# Altium project IBB.PrjPcb (part 1 of 11)
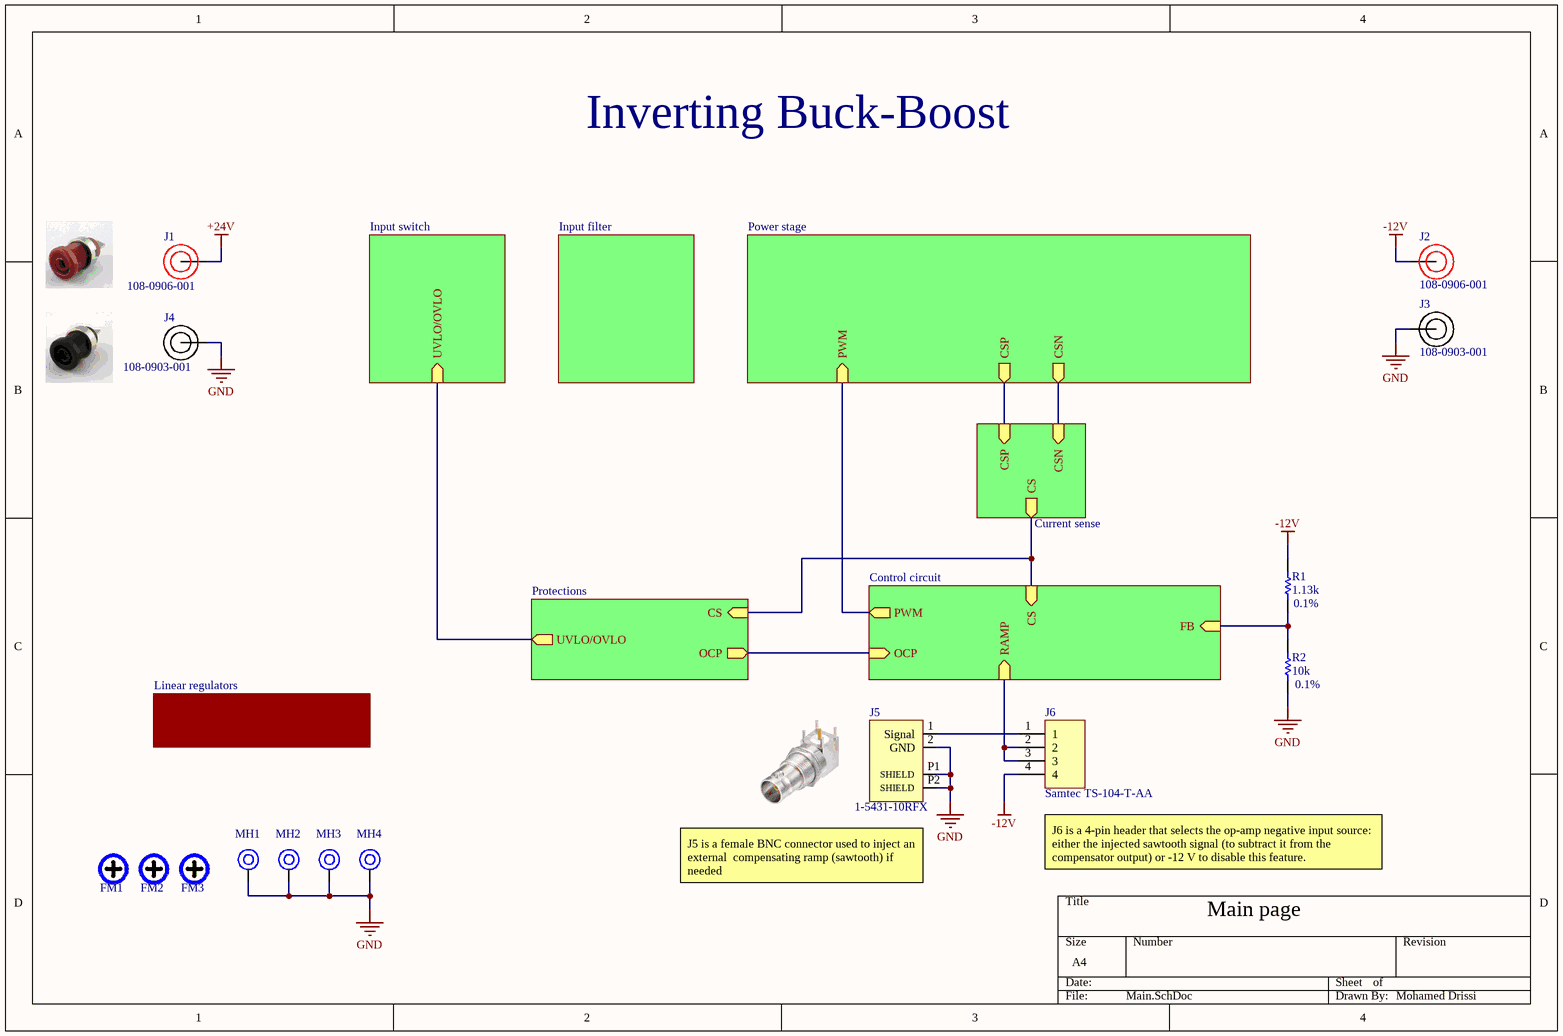
[diagram p0: Main.SchDoc]
Inverting buck boost: Project; Mohamed Drissi: Designer
8 sheets, 213 parts. Net scope: hierarchical (ports join the sheet entries above them; power ports are global).
Board file: PCB.PcbDoc
Sheets:
  Main.SchDoc
    Power stage = Power stage.SchDoc
    Current sense = current sense.SchDoc
    Input switch = Input switch.SchDoc
    Input filter = Input filter.SchDoc
    Protections = Protections.SchDoc
    Linear regulators = Linear regulators.SchDoc
    Control circuit = Control circuit.SchDoc

## Sheet Main.SchDoc
size A4; SheetNumber: 1; SheetTotal: 8

### Parts
FM1  Fiducial Marker  [FIDUCIAL_CROSS_1MM5]  (value not drawn)  (no BOM)
FM2  Fiducial Marker  [FIDUCIAL_CROSS_1MM5]  (value not drawn)  (no BOM)
FM3  Fiducial Marker  [FIDUCIAL_CROSS_1MM5]  (value not drawn)  (no BOM)
J1  108-0906-001  [Black Banana connector Solder terminal]
J2  108-0906-001  [Black Banana connector Solder terminal]
J3  108-0903-001  [Black Banana connector Solder terminal]
J4  108-0903-001  [Black Banana connector Solder terminal]
J5  031-5431-10RFX  [031-5431-10RFX BNC]
J6  Samtec TS-104-T-AA  [CONN HEADER VERT 4POS 2.54MM]
MH1  Mounting Hole  [MOUNTING]  (value not drawn)  (no BOM)
MH2  Mounting Hole  [MOUNTING]  (value not drawn)  (no BOM)
MH3  Mounting Hole  [MOUNTING]  (value not drawn)  (no BOM)
MH4  Mounting Hole  [MOUNTING]  (value not drawn)  (no BOM)
R1  Tolerance: 0.1%  Resistance: 1.13k  [RES_0603]  (hidden comment: RT0603BRD071K13L)
R2  Tolerance: 0.1%  Resistance: 10k  [res_0603]  (hidden comment: ERA-3AEB103V)

### Sub-sheets
Control circuit = Control circuit.SchDoc: FB (in), CS (in), RAMP (in), PWM (out), OCP (in)
Current sense = current sense.SchDoc: CSP (in), CSN (in), CS (out)
Input filter = Input filter.SchDoc: no entries
Input switch = Input switch.SchDoc: UVLO/OVLO (in)
Linear regulators = Linear regulators.SchDoc: no entries
Power stage = Power stage.SchDoc: CSN (out), CSP (out), PWM (in)
Protections = Protections.SchDoc: UVLO/OVLO (out), CS (in), OCP (out)

### Nets
+24V: J1.1
-12V: J2.1 J6.4 R1.2
GND: J3.1 J4.1 J5.2(GND) J5.P1(SHIELD) J5.P2(SHIELD) MH1.1 MH2.1 MH3.1 MH4.1 R2.1
NetC26_1: sheet Power stage/CSN, sheet Current sense/CSN
NetC26_2: sheet Power stage/CSP, sheet Current sense/CSP
NetJ5_1: J5.1(Signal) J6.1
NetJ6_2: J6.2 J6.3 ; sheet Control circuit/RAMP
NetQ3_2: sheet Protections/OCP, sheet Control circuit/OCP
NetQ8_1: sheet Input switch/UVLO/OVLO, sheet Protections/UVLO/OVLO
NetR1_1: R1.1 R2.2 ; sheet Control circuit/FB
NetR77_2: sheet Power stage/PWM, sheet Control circuit/PWM
NetU6_1: sheet Current sense/CS, sheet Protections/CS, sheet Control circuit/CS

### Notes on the sheet
- Inverting Buck-Boost
- (near J5) J5 is a female BNC connector used to inject an external  compensating ramp (sawtooth) if needed
- (near J6) J6 is a 4-pin header that selects the op-amp negative input source: either the injected sawtooth signal (to subtract it from the compensator output) or -12 V to disable this feature.
- Main page
- Mohamed Drissi

### Library data of the parts
FM1-FM3 = FIDUCIAL_CROSS_1MM5: Fiducial Marker Cross 1.5mm NO BOM
J1 J2 = Cinch 108-0906-001: Right-angle Dual Port D-Sub Connector; Manufacturer: Cinch Connectivity Solutions; Approvals: UL; Body Material: Brass, Nylon, Polyamide; Current Rating: 15A; Gender: Female; Insulation: Mating End Insulated; Number of Contacts: 1; Voltage Rating: 3.5kV; Voltage Rating (DC): 7kV; Wire/Cable Gauge: 12AWG; Supplier: Avnet; Supplier Part Number: 39F1578; Manufacturer Part Number: 108-0906-001; RoHS: Compliant; Category: Connectors; Stock: 6182; Pricing: 1=1,33, 10=1,13, 50=1,03, 100=0,961, 250=0,9, 500=0,857, 1000=0,816 (USD); Case/Package: 0906; Color: Orange; Contact Material: Brass; Contact Plating: Tin; Export Control Classification Number (ECCN) Code: EAR99; Insulation Material: Nylon; Lead Free: Lead Free; Length: 23.83mm; Lifecycle Status: Production; Max Current Rating: 15A; Max Operating Temperature: 85°C; Min Operating Temperature: -55°C; Mounting Technology: Panel; Orientation: Straight; Packaging: Bulk; Radiation Hardening: No; REACH SVHC: No; Termination: Solder; ComponentLink1URL: https://datasheet.octopart.com:443/108-0906-001-Cinch-Connectors-datasheet-87927859.pdf?src-supplier=element14+APAC; ComponentLink1Description: https://datasheet.octopart.com:443/108-0906-001-Cinch-Connectors-datasheet-87927859.pdf?src-supplier=element14+APAC; ComponentLink2URL: https://datasheet.octopart.com:443/108-0906-001-Cinch-Connectors-datasheet-26078.pdf?src-supplier=element14+APAC; ComponentLink2Description: https://datasheet.octopart.com:443/108-0906-001-Cinch-Connectors-datasheet-26078.pdf?src-supplier=element14+APAC; ComponentLink3URL: https://datasheet.octopart.com:443/108-0906-001-Cinch-Connectivity-Solutions-datasheet-180501184.pdf?src-supplier=IHS; ComponentLink3Description: https://datasheet.octopart.com:443/108-0906-001-Cinch-Connectivity-Solutions-datasheet-180501184.pdf?src-supplier=IHS; ComponentLink4URL: https://datasheet.octopart.com:443/108-0906-001-Cinch-Connectors-datasheet-13703871.pdf?src-supplier=_legacy+Avnet; ComponentLink4Description: https://datasheet.octopart.com:443/108-0906-001-Cinch-Connectors-datasheet-13703871.pdf?src-supplier=_legacy+Avnet; ComponentLink5URL: https://datasheet.octopart.com:443/108-0906-001-Cinch-Connectivity-Solutions-datasheet-128871933.pdf?src-supplier=RS+(Formerly+Allied+Electronics); ComponentLink5Description: https://datasheet.octopart.com:443/108-0906-001-Cinch-Connectivity-Solutions-datasheet-128871933.pdf?src-supplier=RS+(Formerly+Allied+Electronics); ComponentLink6URL: https://datasheet.octopart.com:443/108-0906-001-Cinch-Connectors-datasheet-10014739.pdf?src-supplier=RS+(Formerly+Allied+Electronics); ComponentLink6Description: https://datasheet.octopart.com:443/108-0906-001-Cinch-Connectors-datasheet-10014739.pdf?src-supplier=RS+(Formerly+Allied+Electronics); ComponentLink7URL: https://datasheet.octopart.com:443/108-0906-001-Emerson-Network-Power-datasheet-16473276.pdf?src-supplier=Farnell; ComponentLink7Description: https://datasheet.octopart.com:443/108-0906-001-Emerson-Network-Power-datasheet-16473276.pdf?src-supplier=Farnell
J3 J4 = Cinch 108-0903-001: Banana Test Connector, 4mm, Jack, Panel Mount, 15 A, 7 kV, Tin Plated Contacts, Black; Manufacturer: Cinch Connectivity Solutions; Approvals: UL; Body Material: Brass, Nylon, Polyamide; Current Rating: 15A; Gender: Female; Insulation: Mating End Insulated; Number of Contacts: 1; Voltage Rating: 3.5kV; Voltage Rating (DC): 7kV; Wire/Cable Gauge: 12AWG; Supplier: RS; Supplier Part Number: 8860910; Manufacturer Part Number: 108-0903-001; RoHS: Compliant; Category: Connectors; Stock: 5600; Pricing: 50=0,928, 500=0,742, 1000=0,699 (EUR); Color: Black; Contact Material: Tin; Contact Plating: Tin; Country of Origin: USA; Export Control Classification Number (ECCN) Code: EAR99; Insulation Material: Nylon; Lead Free: Lead Free; Length: 23.83mm; Lifecycle Status: Production; Max Current Rating: 15A; Max Operating Temperature: 85°C; Min Operating Temperature: -55°C; Mounting Technology: Panel; Orientation: Straight; Packaging: Bulk; Radiation Hardening: No; REACH SVHC: No; Termination: Solder; ComponentLink1URL: https://datasheet.octopart.com:443/108-0903-001-Cinch-Connectivity-Solutions-datasheet-128871933.pdf?src-supplier=JRH+Electronics; ComponentLink1Description: https://datasheet.octopart.com:443/108-0903-001-Cinch-Connectivity-Solutions-datasheet-128871933.pdf?src-supplier=JRH+Electronics; ComponentLink2URL: https://datasheet.octopart.com:443/108-0903-001-Cinch-Connectors-datasheet-38159153.pdf?src-supplier=element14+APAC; ComponentLink2Description: https://datasheet.octopart.com:443/108-0903-001-Cinch-Connectors-datasheet-38159153.pdf?src-supplier=element14+APAC; ComponentLink3URL: https://datasheet.octopart.com:443/108-0903-001-Cinch-Connectivity-Solutions-datasheet-180501184.pdf?src-supplier=IHS; ComponentLink3Description: https://datasheet.octopart.com:443/108-0903-001-Cinch-Connectivity-Solutions-datasheet-180501184.pdf?src-supplier=IHS; ComponentLink4URL: https://datasheet.octopart.com:443/108-0903-001-Emerson-Network-Power-datasheet-82039.pdf?src-supplier=element14; ComponentLink4Description: https://datasheet.octopart.com:443/108-0903-001-Emerson-Network-Power-datasheet-82039.pdf?src-supplier=element14; ComponentLink5URL: https://datasheet.octopart.com:443/108-0903-001-Cinch-Connectors-datasheet-13701575.pdf?src-supplier=_legacy+Avnet; ComponentLink5Description: https://datasheet.octopart.com:443/108-0903-001-Cinch-Connectors-datasheet-13701575.pdf?src-supplier=_legacy+Avnet; ComponentLink6URL: https://datasheet.octopart.com:443/108-0903-001-Cinch-Connectors-datasheet-9780463.pdf?src-supplier=RS+(Formerly+Allied+Electronics); ComponentLink6Description: https://datasheet.octopart.com:443/108-0903-001-Cinch-Connectors-datasheet-9780463.pdf?src-supplier=RS+(Formerly+Allied+Electronics); ComponentLink7URL: https://datasheet.octopart.com:443/108-0903-001-Emerson-Network-Power-datasheet-8828422.pdf?src-supplier=Farnell; ComponentLink7Description: https://datasheet.octopart.com:443/108-0903-001-Emerson-Network-Power-datasheet-8828422.pdf?src-supplier=Farnell; ComponentLink8URL: https://datasheet.octopart.com:443/108-0903-001-Emerson-Network-Power-datasheet-10031126.pdf?src-supplier=Farnell; ComponentLink8Description: https://datasheet.octopart.com:443/108-0903-001-Emerson-Network-Power-datasheet-10031126.pdf?src-supplier=Farnell; ComponentLink9URL: https://datasheet.octopart.com:443/108-0903-001-Emerson-Network-Power-datasheet-47159.pdf?src-supplier=Farnell; ComponentLink9Description: https://datasheet.octopart.com:443/108-0903-001-Emerson-Network-Power-datasheet-47159.pdf?src-supplier=Farnell; ComponentLink10URL: https://datasheet.octopart.com:443/108-0903-001-Emerson-Network-Power-datasheet-40124.pdf?src-supplier=Farnell; ComponentLink10Description: https://datasheet.octopart.com:443/108-0903-001-Emerson-Network-Power-datasheet-40124.pdf?src-supplier=Farnell; ComponentLink11URL: https://datasheet.octopart.com:443/108-0903-001-Emerson-Network-Power-datasheet-29036.pdf?src-supplier=Farnell; ComponentLink11Description: https://datasheet.octopart.com:443/108-0903-001-Emerson-Network-Power-datasheet-29036.pdf?src-supplier=Farnell
J5 = Amphenol 031-5431-10RFX: RF BNC Connector, Female, Panel Mount, Board And Panel Mount, Solder Terminal, Jack; Manufacturer: Amphenol RF; Body Material: Zinc; Body Plating: Nickel; Connector Type: Receptacle; Dielectric Material: Polypropylene; Frequency: 4GHz; Impedance: 50Ω; Insertion Loss (dB): 0.2dB; Clock Frequency: 1GHz; Polarity: Standard; Voltage Rating: 500V; Supplier: RS; Supplier Part Number: 1440890; Manufacturer Part Number: 031-5431-10RFX; RoHS: Compliant; Category: RF / Coaxial Connectors; Stock: 106; Pricing: 2=3,93, 20=3,77, 40=3,46, 100=3,145, 200=2,985 (EUR); Contact Material: Bronze, Copper; Contact Plating: Gold; Export Control Classification Number (ECCN) Code: EAR99; Fastening Type: Bayonet; Gender: Female; Housing Color: White; Harmonized Tariff Schedule (HTS) Code: 8536.69.40.10; Introduction Date: 2000-11-01; Lifecycle Status: Production; Max Operating Temperature: 85°C; Min Operating Temperature: -55°C; Mounting Technology: Bulkhead, PCB, Panel, Through Hole; Orientation: Right Angle; Plating: Nickel; Radiation Hardening: No; REACH SVHC: Unknown; Schedule B: 8536695050, 8536695050|8536695050, 8536695050|8536695050|8536695050, 8536695050|8536695050|8536695050|8536695050; Termination: Solder; ComponentLink1URL: https://datasheet.octopart.com:443/031-5431-10RFX-Amphenol-RF-datasheet-178912673.pdf?src-supplier=Amphenol+RF; ComponentLink1Description: https://datasheet.octopart.com:443/031-5431-10RFX-Amphenol-RF-datasheet-178912673.pdf?src-supplier=Amphenol+RF; ComponentLink2URL: https://datasheet.octopart.com:443/031-5431-10RFX-Amphenol-RF-datasheet-69052.pdf?src-supplier=RS+(Formerly+Allied+Electronics); ComponentLink2Description: https://datasheet.octopart.com:443/031-5431-10RFX-Amphenol-RF-datasheet-69052.pdf?src-supplier=RS+(Formerly+Allied+Electronics); ComponentLink3URL: https://datasheet.octopart.com:443/031-5431-10RFX-Amphenol-RF-datasheet-120229763.pdf?src-supplier=TME; ComponentLink3Description: https://datasheet.octopart.com:443/031-5431-10RFX-Amphenol-RF-datasheet-120229763.pdf?src-supplier=TME; ComponentLink4URL: https://datasheet.octopart.com:443/31-5431-10RFX-Amphenol-datasheet-110605730.pdf?src-supplier=IHS; ComponentLink4Description: https://datasheet.octopart.com:443/31-5431-10RFX-Amphenol-datasheet-110605730.pdf?src-supplier=IHS; ComponentLink5URL: https://datasheet.octopart.com:443/031-5431-10RFX-Amphenol-RF-datasheet-14873985.pdf?src-supplier=Electro+Sonic; ComponentLink5Description: https://datasheet.octopart.com:443/031-5431-10RFX-Amphenol-RF-datasheet-14873985.pdf?src-supplier=Electro+Sonic; ComponentLink6URL: https://datasheet.octopart.com:443/031-5431-10RFX-Amphenol-RF-datasheet-11551920.pdf?src-supplier=Electro+Sonic; ComponentLink6Description: https://datasheet.octopart.com:443/031-5431-10RFX-Amphenol-RF-datasheet-11551920.pdf?src-supplier=Electro+Sonic; ComponentLink7URL: https://datasheet.octopart.com:443/031-5431-10RFX-Amphenol-RF-datasheet-10025382.pdf?src-supplier=Newark; ComponentLink7Description: https://datasheet.octopart.com:443/031-5431-10RFX-Amphenol-RF-datasheet-10025382.pdf?src-supplier=Newark; ComponentLink8URL: https://datasheet.octopart.com:443/031-5431-10RFX-Amphenol-RF-datasheet-181430700.pdf?src-supplier=JRH+Electronics; ComponentLink8Description: https://datasheet.octopart.com:443/031-5431-10RFX-Amphenol-RF-datasheet-181430700.pdf?src-supplier=JRH+Electronics; ComponentLink9URL: https://datasheet.octopart.com:443/031-5431-10RFX.-Amphenol-RF-datasheet-5334842.pdf?src-supplier=element14+APAC; ComponentLink9Description: https://datasheet.octopart.com:443/031-5431-10RFX.-Amphenol-RF-datasheet-5334842.pdf?src-supplier=element14+APAC
J6 = Samtec TS-104-T-AA: Pin Header, Precision Machined Terminal, Board-to-Board, 2.54 mm, 1 Rows, 4 Contacts, Through Hole; Manufacturer Lifecycle Status: PRODUCTION; Gender: Male; Max Current Rating: 1A; Number of Contacts: 4; Pitch: 2.54mm; Supplier: RS; Supplier Part Number: 2001484; Manufacturer: Samtec; Manufacturer Part Number: TS-104-T-AA; RoHS: Compliant; Category: Board to Board Connectors; Stock: 2; Pricing: 1=0,88, 10=0,71, 100=0,63, 250=0,56 (EUR); Contact Material: Brass; Contact Plating: Tin; Lifecycle Status: Production; Max Operating Temperature: 105°C; Min Operating Temperature: -55°C; Mounting Technology: Through Hole; Number of Rows: 1; Orientation: Straight; Radiation Hardening: No; REACH SVHC: No; Termination: Solder; ComponentLink1URL: https://datasheet.octopart.com:443/TS-104-T-AA-Samtec-datasheet-97318998.pdf?src-supplier=Master+Electronics; ComponentLink1Description: https://datasheet.octopart.com:443/TS-104-T-AA-Samtec-datasheet-97318998.pdf?src-supplier=Master+Electronics; ComponentLink2URL: https://datasheet.octopart.com:443/TS-104-T-AA-Samtec-datasheet-150856305.pdf?src-supplier=Electro+Sonic; ComponentLink2Description: https://datasheet.octopart.com:443/TS-104-T-AA-Samtec-datasheet-150856305.pdf?src-supplier=Electro+Sonic; ComponentLink3URL: https://datasheet.octopart.com:443/TS-104-T-AA-Samtec-datasheet-13698575.pdf?src-supplier=Electro+Sonic; ComponentLink3Description: https://datasheet.octopart.com:443/TS-104-T-AA-Samtec-datasheet-13698575.pdf?src-supplier=Electro+Sonic; ComponentLink4URL: https://datasheet.octopart.com:443/TS-104-T-AA-Samtec-datasheet-37173861.pdf?src-supplier=Electro+Sonic; ComponentLink4Description: https://datasheet.octopart.com:443/TS-104-T-AA-Samtec-datasheet-37173861.pdf?src-supplier=Electro+Sonic; ComponentLink5URL: https://datasheet.octopart.com:443/TS-104-T-AA-Samtec-datasheet-41643166.pdf?src-supplier=Farnell; ComponentLink5Description: https://datasheet.octopart.com:443/TS-104-T-AA-Samtec-datasheet-41643166.pdf?src-supplier=Farnell; ComponentLink6URL: https://datasheet.octopart.com:443/TS-104-T-AA-Samtec-datasheet-28904454.pdf?src-supplier=Farnell; ComponentLink6Description: https://datasheet.octopart.com:443/TS-104-T-AA-Samtec-datasheet-28904454.pdf?src-supplier=Farnell; ComponentLink7URL: https://datasheet.octopart.com:443/TS-104-T-AA-Samtec-datasheet-8451641.pdf?src-supplier=Farnell; ComponentLink7Description: https://datasheet.octopart.com:443/TS-104-T-AA-Samtec-datasheet-8451641.pdf?src-supplier=Farnell; ComponentLink8URL: https://datasheet.octopart.com:443/TS-104-T-AA-Samtec-datasheet-179090728.pdf?src-supplier=Sager+Electronics; ComponentLink8Description: https://datasheet.octopart.com:443/TS-104-T-AA-Samtec-datasheet-179090728.pdf?src-supplier=Sager+Electronics; ComponentLink9URL: https://datasheet.octopart.com:443/TS-104-T-AA-Samtec-datasheet-118235246.pdf?src-supplier=Sager+Electronics; ComponentLink9Description: https://datasheet.octopart.com:443/TS-104-T-AA-Samtec-datasheet-118235246.pdf?src-supplier=Sager+Electronics; ComponentLink10URL: https://datasheet.octopart.com:443/TS-104-T-AA-Samtec-datasheet-116533476.pdf?src-supplier=Toby+Electronics; ComponentLink10Description: https://datasheet.octopart.com:443/TS-104-T-AA-Samtec-datasheet-116533476.pdf?src-supplier=Toby+Electronics; ComponentLink11URL: https://datasheet.octopart.com:443/TS-104-T-AA-Samtec-datasheet-116536303.pdf?src-supplier=Toby+Electronics; ComponentLink11Description: https://datasheet.octopart.com:443/TS-104-T-AA-Samtec-datasheet-116536303.pdf?src-supplier=Toby+Electronics
MH1-MH4 = MH_3.5H_6D: Manufacturer Part Number: NA; Case/Package: TH; Manufacturer: NA; Supplier-1: NA
R1 = Panasonic RT0603BRD071K13L: Res Thin Film 0603 1.13K Ohm 0.1% 0.1W(1/10W) ±25ppm/C Pad SMD T/R; Manufacturer: Yageo Group; Max Power Dissipation: 100mW; Temperature Coefficient: 25ppm/°C; Voltage Rating: 75V; Voltage Rating (DC): 50V; Supplier: Arrow Electronics; Supplier Part Number: RT0603BRD071K13L; Manufacturer Part Number: RT0603BRD071K13L; RoHS: Compliant; Category: Chip SMD Resistors; Stock: 2853; Pricing: 1=0,0998, 10=0,0669, 25=0,0627, 50=0,0591, 100=0,0558, 250=0,0518, 500=0,049, 1000=0,0464 (USD); Case/Package: 0603; Case Code (Imperial): 0603; China RoHS: Non-Compliant; Composition: Thin Film; Contact Plating: Tin; Country of Origin: Mainland China, Taiwan; Depth: 800µm; Export Control Classification Number (ECCN) Code: EAR99; Height: 450µm; Harmonized Tariff Schedule (HTS) Code: 8533.21.00.30; Introduction Date: 2008-06-09; Lead Free: Lead Free; Length: 1.6mm; Lifecycle Status: Production; Max Operating Temperature: 155°C; Military Standard: Not; Min Operating Temperature: -55°C; Mounting Technology: Surface Mount; Number of Terminals: 2; Number of Terminations: 2; Power Rating: 100mW; Radiation Hardening: No; REACH SVHC: Yes; Schedule B: 8533210045, 8533210045|8533210045|8533210045|8533210045|8533210045; Termination: SMD/SMT; Weight: 2.012816mg; Width: 800µm; Working Voltage: 75V; ComponentLink1URL: https://datasheet.octopart.com:443/RT0603BRD071K13L-Yageo-datasheet-176402239.pdf?src-supplier=Future+Electronics; ComponentLink1Description: https://datasheet.octopart.com:443/RT0603BRD071K13L-Yageo-datasheet-176402239.pdf?src-supplier=Future+Electronics; ComponentLink2URL: https://datasheet.octopart.com:443/RT0603BRD071K13L-Yageo-datasheet-169971040.pdf?src-supplier=Future+Electronics; ComponentLink2Description: https://datasheet.octopart.com:443/RT0603BRD071K13L-Yageo-datasheet-169971040.pdf?src-supplier=Future+Electronics; ComponentLink3URL: https://datasheet.octopart.com:443/RT0603BRD071K13L-Yageo-datasheet-166250672.pdf?src-supplier=Future+Electronics; ComponentLink3Description: https://datasheet.octopart.com:443/RT0603BRD071K13L-Yageo-datasheet-166250672.pdf?src-supplier=Future+Electronics; ComponentLink4URL: https://datasheet.octopart.com:443/RT0603BRD071K13L-Yageo-datasheet-137700930.pdf?src-supplier=Future+Electronics; ComponentLink4Description: https://datasheet.octopart.com:443/RT0603BRD071K13L-Yageo-datasheet-137700930.pdf?src-supplier=Future+Electronics; ComponentLink5URL: https://datasheet.octopart.com:443/RT0603BRD071K13L-Yageo-datasheet-96443642.pdf?src-supplier=Upverter; ComponentLink5Description: https://datasheet.octopart.com:443/RT0603BRD071K13L-Yageo-datasheet-96443642.pdf?src-supplier=Upverter; ComponentLink6URL: https://datasheet.octopart.com:443/RT0603BRD071K13L-Yageo-Group-datasheet-141265893.pdf?src-supplier=ODG+(Origin+Data+Global); ComponentLink6Description: https://datasheet.octopart.com:443/RT0603BRD071K13L-Yageo-Group-datasheet-141265893.pdf?src-supplier=ODG+(Origin+Data+Global); ComponentLink7URL: https://datasheet.octopart.com:443/RT0603BRD071K13L-Yageo-datasheet-10915759.pdf?src-supplier=_legacy+Avnet; ComponentLink7Description: https://datasheet.octopart.com:443/RT0603BRD071K13L-Yageo-datasheet-10915759.pdf?src-supplier=_legacy+Avnet; ComponentLink8URL: https://datasheet.octopart.com/RT0603BRD071K13L-Yageo-datasheet-86813807.pdf; ComponentLink8Description: https://datasheet.octopart.com/RT0603BRD071K13L-Yageo-datasheet-86813807.pdf; ComponentLink9URL: http://sigma.octopart.com:80/conflict_mineral_statement/Yageo-company-3.pdf?src-supplier=Compliance+Statements; ComponentLink9Description: http://sigma.octopart.com:80/conflict_mineral_statement/Yageo-company-3.pdf?src-supplier=Compliance+Statements; ComponentLink10URL: http://sigma.octopart.com:80/rohs_statement/Yageo-company-2.pdf?src-supplier=Compliance+Statements; ComponentLink10Description: http://sigma.octopart.com:80/rohs_statement/Yageo-company-2.pdf?src-supplier=Compliance+Statements
R2 = Panasonic ERA-3AEB103V: Res Thin Film 0603 10K Ohm 0.1% 1/10W ±25ppm/°C Molded SMD SMD Punched Carrier T/R; Manufacturer Lifecycle Status: ACTIVE; Part Series: Thin Film Chip Resistors, High Reliability Type; Max Power Dissipation: 100mW; Voltage Rating: 75V; Supplier: RS; Supplier Part Number: 566890P; Manufacturer: Panasonic; Manufacturer Part Number: ERA-3AEB103V; RoHS: Compliant; Category: Chip SMD Resistors; Stock: 165600; Pricing: 50=0,056, 100=0,046, 250=0,04, 500=0,036 (EUR); Case/Package: 0603; Case Code (Imperial): 0603; Composition: Thin Film; Contact Plating: Tin; Country of Origin: Japan; Depth: 800µm; Export Control Classification Number (ECCN) Code: EAR99; Height: 450µm; Harmonized Tariff Schedule (HTS) Code: 8533.21.00.30; Introduction Date: 2008-03-19; Lead Free: Lead Free; Length: 1.6mm; Lifecycle Status: Production; Max Operating Temperature: 155°C; Military Standard: Not; Min Operating Temperature: -55°C; Mounting Technology: Surface Mount; Pins: 2; Number of Terminals: 2; Number of Terminations: 2; Packaging: Cut Tape; Power Rating: 100mW; Radiation Hardening: No; Ratings: AEC-Q200; REACH SVHC: Yes; Schedule B: 8533210045, 8533210045|8533210045|8533210045|8533210045|8533210045|8533210045|8533210045|8533210045|8533210045|8533210045|8533210045|8533210045|8533210045|8533210045|8533210045|8533210045|8533210045|8533210045|8533210045|8533210045|8533210045|8533210045|8533210045|85; Temperature Coefficient: 25ppm/°C; Termination: SMD/SMT; Voltage Rating (DC): 75V; Width: 800µm; Working Voltage: 75V; ComponentLink1URL: https://datasheet.octopart.com:443/ERA-3AEB103V-Panasonic-datasheet-62287448.pdf?src-supplier=Newark; ComponentLink1Description: https://datasheet.octopart.com:443/ERA-3AEB103V-Panasonic-datasheet-62287448.pdf?src-supplier=Newark; ComponentLink2URL: https://datasheet.octopart.com:443/ERA-3AEB103V-Panasonic-datasheet-118567.pdf?src-supplier=Newark; ComponentLink2Description: https://datasheet.octopart.com:443/ERA-3AEB103V-Panasonic-datasheet-118567.pdf?src-supplier=Newark; ComponentLink3URL: https://datasheet.octopart.com:443/ERA-3AEB103V-Panasonic-datasheet-61114971.pdf?src-supplier=Newark; ComponentLink3Description: https://datasheet.octopart.com:443/ERA-3AEB103V-Panasonic-datasheet-61114971.pdf?src-supplier=Newark; ComponentLink4URL: https://datasheet.octopart.com:443/ERA3AEB103V-Panasonic-datasheet-22087624.pdf?src-supplier=Newark; ComponentLink4Description: https://datasheet.octopart.com:443/ERA3AEB103V-Panasonic-datasheet-22087624.pdf?src-supplier=Newark; ComponentLink5URL: https://sigma.octopart.com:443/138766958/technical_drawing/Panasonic-ERA-3AEB103V.pdf?src-supplier=Upverter; ComponentLink5Description: https://sigma.octopart.com:443/138766958/technical_drawing/Panasonic-ERA-3AEB103V.pdf?src-supplier=Upverter; ComponentLink6URL: https://datasheet.octopart.com:443/ERA-3AEB103V-Panasonic-datasheet-136531316.pdf?src-supplier=Farnell; ComponentLink6Description: https://datasheet.octopart.com:443/ERA-3AEB103V-Panasonic-datasheet-136531316.pdf?src-supplier=Farnell; ComponentLink7URL: https://datasheet.octopart.com:443/ERA-3AEB103V-Panasonic-datasheet-13266200.pdf?src-supplier=RS+(Formerly+Allied+Electronics); ComponentLink7Description: https://datasheet.octopart.com:443/ERA-3AEB103V-Panasonic-datasheet-13266200.pdf?src-supplier=RS+(Formerly+Allied+Electronics); ComponentLink8URL: https://datasheet.octopart.com:443/ERA-3AEB103V-Panasonic-datasheet-46744048.pdf?src-supplier=RS+(Formerly+Allied+Electronics); ComponentLink8Description: https://datasheet.octopart.com:443/ERA-3AEB103V-Panasonic-datasheet-46744048.pdf?src-supplier=RS+(Formerly+Allied+Electronics); ComponentLink9URL: https://datasheet.octopart.com:443/ERA-3AEB103V-Panasonic-datasheet-10840895.pdf?src-supplier=Future+Electronics; ComponentLink9Description: https://datasheet.octopart.com:443/ERA-3AEB103V-Panasonic-datasheet-10840895.pdf?src-supplier=Future+Electronics; ComponentLink10URL: https://datasheet.octopart.com:443/ERA-3AEB103V-Panasonic-datasheet-8367715.pdf?src-supplier=Future+Electronics; ComponentLink10Description: https://datasheet.octopart.com:443/ERA-3AEB103V-Panasonic-datasheet-8367715.pdf?src-supplier=Future+Electronics; ComponentLink11URL: https://datasheet.octopart.com:443/ERA-3AEB103V-Panasonic-datasheet-12510007.pdf?src-supplier=Future+Electronics; ComponentLink11Description: https://datasheet.octopart.com:443/ERA-3AEB103V-Panasonic-datasheet-12510007.pdf?src-supplier=Future+Electronics; ComponentLink12URL: https://datasheet.octopart.com:443/ERA-3AEB103V-Panasonic-datasheet-11763931.pdf?src-supplier=Future+Electronics; ComponentLink12Description: https://datasheet.octopart.com:443/ERA-3AEB103V-Panasonic-datasheet-11763931.pdf?src-supplier=Future+Electronics; ComponentLink13URL: https://datasheet.octopart.com:443/ERA-3AEB103V-Panasonic-datasheet-5392808.pdf?src-supplier=Future+Electronics; ComponentLink13Description: https://datasheet.octopart.com:443/ERA-3AEB103V-Panasonic-datasheet-5392808.pdf?src-supplier=Future+Electronics; ComponentLink14URL: https://datasheet.octopart.com:443/ERA-3AEB103V-Panasonic-datasheet-154766165.pdf?src-supplier=Master+Electronics; ComponentLink14Description: https://datasheet.octopart.com:443/ERA-3AEB103V-Panasonic-datasheet-154766165.pdf?src-supplier=Master+Electronics; ComponentLink15URL: https://datasheet.octopart.com:443/ERA3AEB103V-Panasonic-datasheet-188913046.pdf?src-supplier=TME; ComponentLink15Description: https://datasheet.octopart.com:443/ERA3AEB103V-Panasonic-datasheet-188913046.pdf?src-supplier=TME; ComponentLink16URL: https://sigma.octopart.com:443/150570796/technical_drawing/Panasonic-ERA3AEB103V.pdf?src-supplier=Panasonic+SCT; ComponentLink16Description: https://sigma.octopart.com:443/150570796/technical_drawing/Panasonic-ERA3AEB103V.pdf?src-supplier=Panasonic+SCT; ComponentLink17URL: https://datasheet.octopart.com:443/ERA3AEB103V-Panasonic-datasheet-138783076.pdf?src-supplier=Burklin+Elektronik; ComponentLink17Description: https://datasheet.octopart.com:443/ERA3AEB103V-Panasonic-datasheet-138783076.pdf?src-supplier=Burklin+Elektronik; ComponentLink18URL: https://datasheet.octopart.com/ERA-3AEB103V-Panasonic-datasheet-78375410.pdf; ComponentLink18Description: https://datasheet.octopart.com/ERA-3AEB103V-Panasonic-datasheet-78375410.pdf; ComponentLink19URL: https://datasheet.octopart.com:443/ERA-3AEB103V-Panasonic-datasheet-10050158.pdf?src-supplier=Arrow+Electronics; ComponentLink19Description: https://datasheet.octopart.com:443/ERA-3AEB103V-Panasonic-datasheet-10050158.pdf?src-supplier=Arrow+Electronics; ComponentLink20URL: https://datasheet.octopart.com:443/ERA-3AEB103V-Panasonic-datasheet-33006989.pdf?src-supplier=Electro+Sonic; ComponentLink20Description: https://datasheet.octopart.com:443/ERA-3AEB103V-Panasonic-datasheet-33006989.pdf?src-supplier=Electro+Sonic

## Sheet Power stage.SchDoc
size A3; DrawnBy: Mohamed Drissi; SheetNumber: 2; SheetTotal: 8
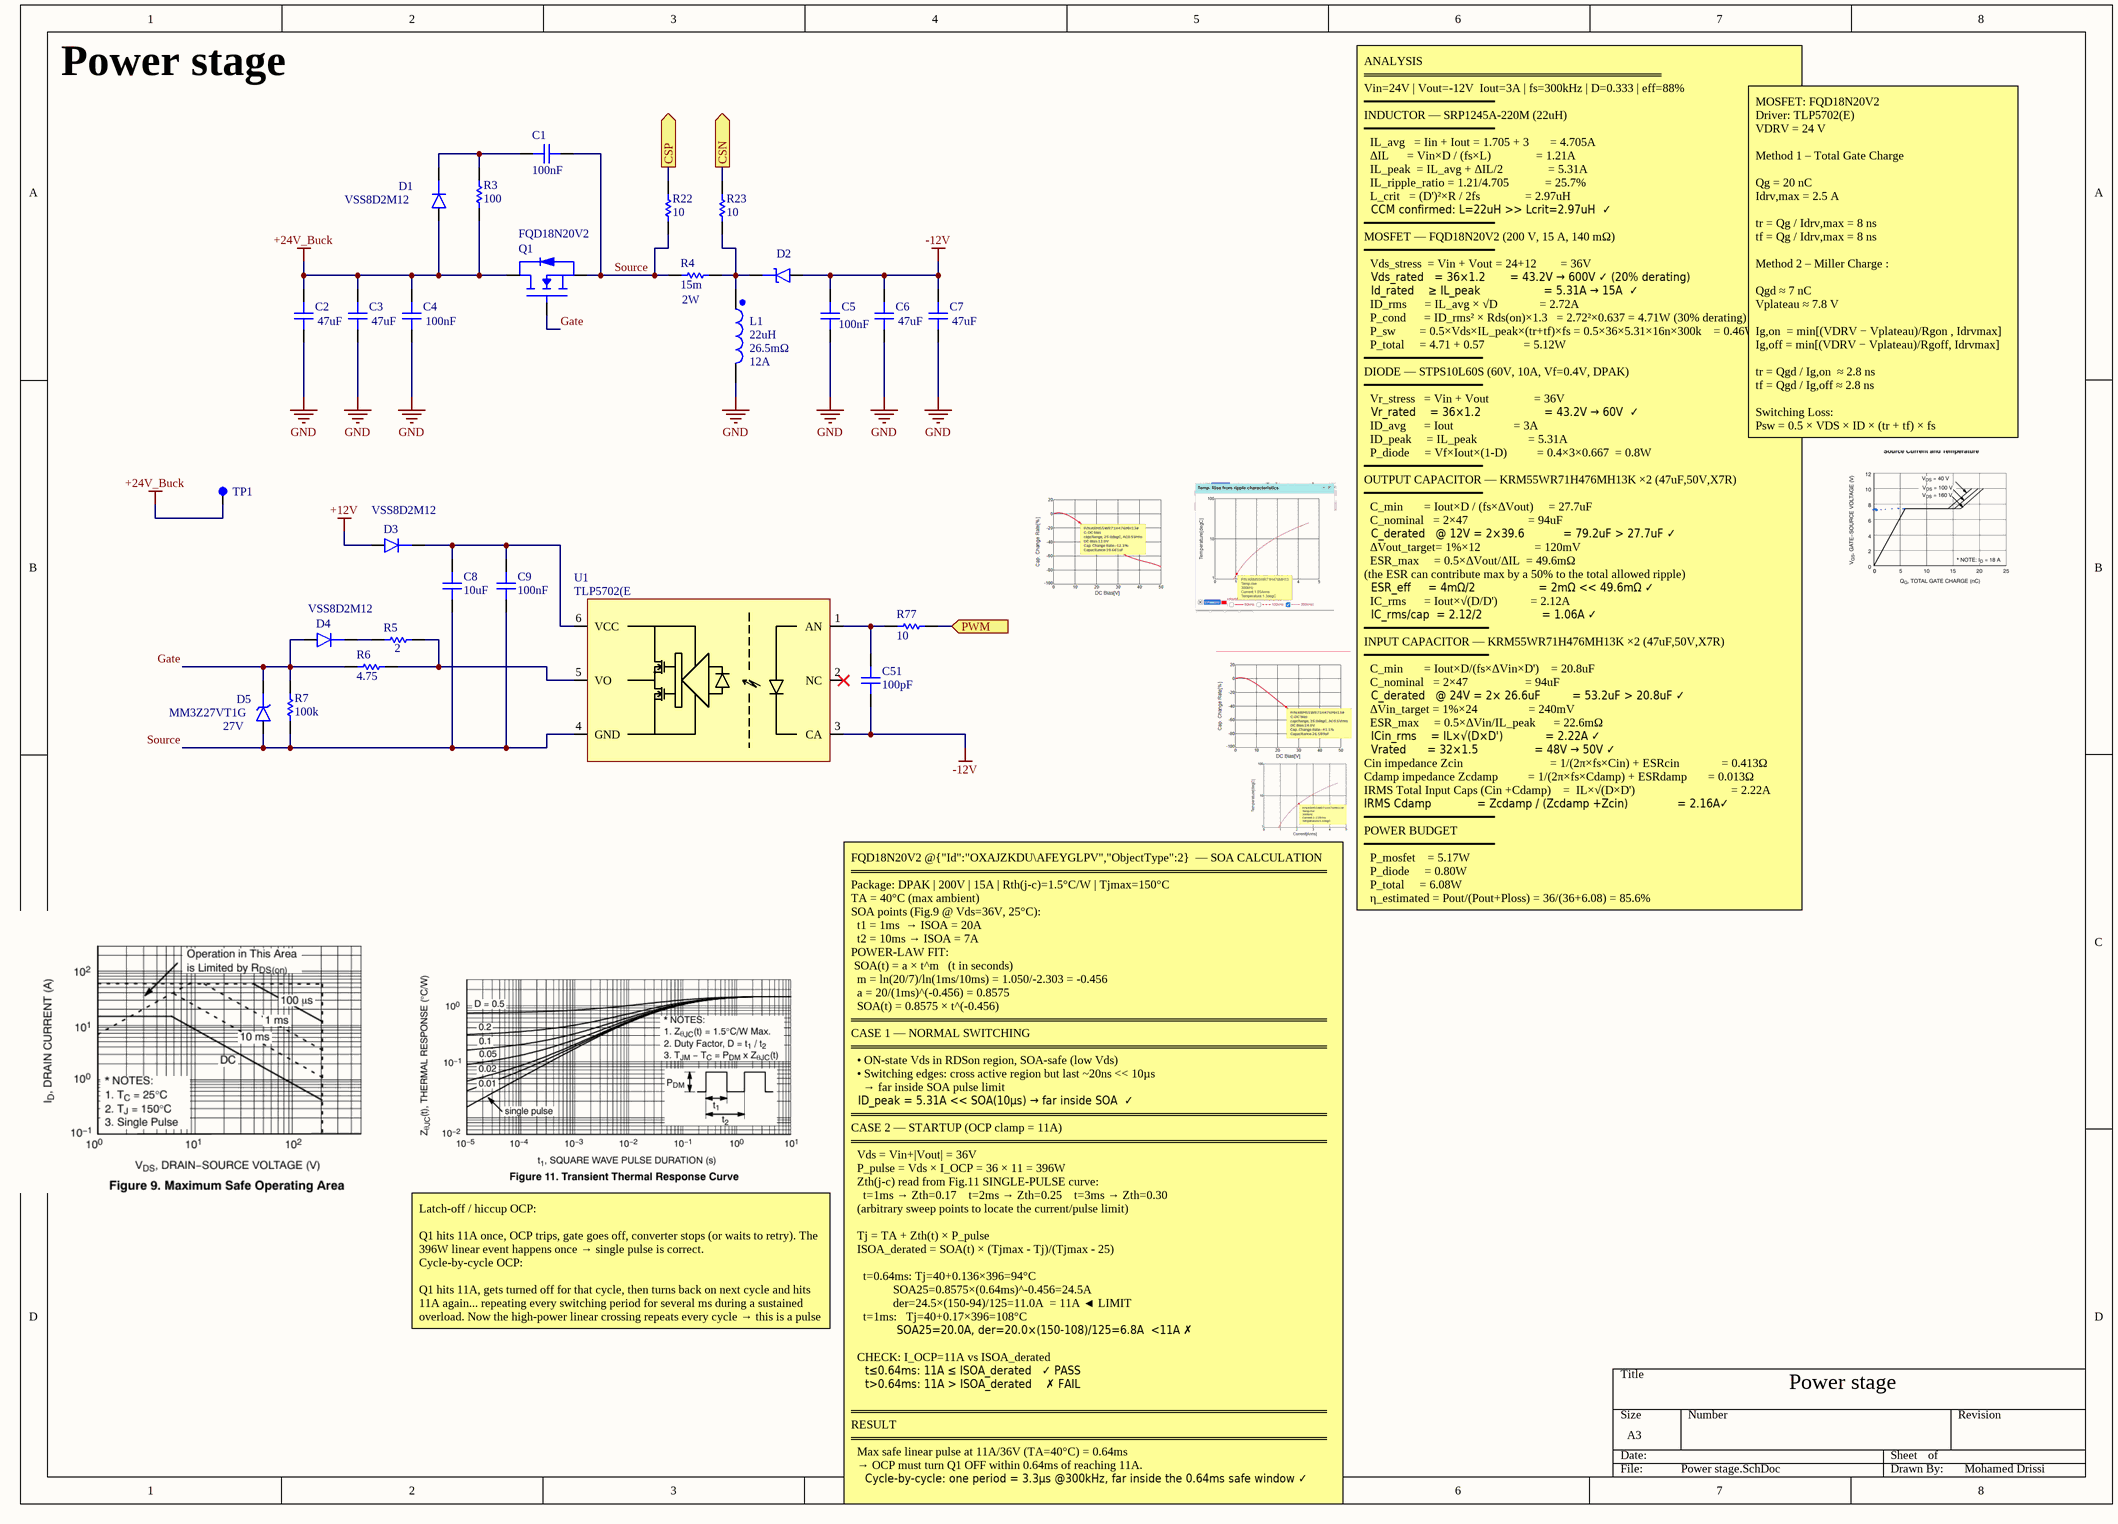
[diagram p1: Power stage.SchDoc]

### Parts
C1  Capacitance: 100nF  [cap_0603]  (hidden comment: GMC10X7R104K100NT)
C2  Capacitance: 47uF  [cap_2220]  (hidden comment: KRM55WR71H476MH13K)
C3  Capacitance: 47uF  [cap_2220]  (hidden comment: KRM55WR71H476MH13K)
C4  Capacitance: 100nF  [cap_0603]  (hidden comment: GMC10X7R104K100NT)
C5  Capacitance: 100nF  [cap_0603]  (hidden comment: GMC10X7R104K100NT)
C6  Capacitance: 47uF  [cap_2220]  (hidden comment: KRM55WR71H476MH13K)
C7  Capacitance: 47uF  [cap_2220]  (hidden comment: KRM55WR71H476MH13K)
C8  Capacitance: 10uF  [cap_1210]  (hidden comment: 885012209073)
C9  Capacitance: 100nF  [cap_0603]  (hidden comment: GMC10X7R104K100NT)
C51  Capacitance: 100pF  [Cap_0603]  (hidden comment: GCM1885C2A101JA16D)
D1  VSS8D2M12  [DO-221AD]
D2  STPS10L60D  [TO-220]  (value not drawn)
D3  VSS8D2M12  [DO-221AD]
D4  VSS8D2M12  [DO-221AD]
D5  MM3Z27VT1G  Reference Voltage: 27V  [SOD-323]
L1  Max Current Rating: 12A  DC Resistance (DCR): 26.5mΩ  Inductance: 22uH  [MWLA1707S]  (hidden comment: MWLA1707S-220MT)
Q1  FQD18N20V2  [TO-252  (DPAK)]
R3  Resistance: 100  [res_2512]  (hidden comment: CPA2512E1000FS-T10)
R4  Resistance: 15m  Power: 2W  [res_2512]  (hidden comment: D1MPAB2512QR015FA-T4)
R5  value 2  [res_0603]  (hidden comment: CRCW06032R00FKEA)
R6  value 4.75  [res_0603]  (hidden comment: CRCW06034R75FKEAHP)
R7  Resistance: 100k  [res_0603]  (hidden comment: CRCW0603100KFKEA)
R22  Resistance: 10  [res_0603]  (hidden comment: RC0603FR-0710RL)
R23  Resistance: 10  [res_0603]  (hidden comment: RC0603FR-0710RL)
R77  Resisitance: 10  [res_0603]  (hidden comment: RT0603BRE0710RL)
TP1  5000  [TH TP]  (value not drawn)
U1  TLP5702(E  [TOSHIBA: 11-4N1A]

### Ports
CSN (out, see Main[3B], current sense[2B]), CSP (out, see Main[3B], current sense[2B]), PWM (in, see Main[3B], Control circuit[4B])

### Nets
+12V: D3.A
+24V_Buck: C2.2 C3.2 C4.2 D1.A Q1.2(D) R3.1 TP1.1
-12V: C5.2 C6.2 C7.2 C51.1 D2.2(A) U1.3(CA)
GND: C2.1 C3.1 C4.1 C5.1 C6.1 C7.1 L1.2
Gate: D4.A D5.k(C) Q1.1(G) R6.1 R7.2
Source: C1.1 C8.1 C9.1 D5.A Q1.3(S) R4.1 R7.1 R22.1 U1.4(GND)
NetC1_2: C1.2 D1.C R3.2
NetC8_2: C8.2 C9.2 D3.C U1.6(VCC)
NetC26_1: R23.2 ; port CSN
NetC26_2: R22.2 ; port CSP
NetC51_2: C51.2 R77.1 U1.1(AN)
NetD2_1: D2.1(K) L1.1 R4.2 R23.1
NetD4_C: D4.C R5.1
NetR5_2: R5.2 R6.2 U1.5(VO)
NetR77_2: R77.2 ; port PWM

Not connected (* = marked no-connect by the designer): U1 2(NC)*

### Notes on the sheet
- Power stage
- MOSFET: FQD18N20V2
  Driver: TLP5702(E)
  VDRV = 24 V
  Method 1 – Total Gate Charge
  Qg = 20 nC
  Idrv,max = 2.5 A
  tr = Qg / Idrv,max = 8 ns
  tf = Qg / Idrv,max = 8 ns
  Method 2 – Miller Charge :
  Qgd ≈ 7 nC
  Vplateau ≈ 7.8 V
  Ig,on  = min[(VDRV − Vplateau)/Rgon , Idrvmax]
  Ig,off = min[(VDRV − Vplateau)/Rgoff, Idrvmax]
  tr = Qgd / Ig,on  ≈ 2.8 ns
  tf = Qgd / Ig,off ≈ 2.8 ns
  Switching Loss:
  Psw = 0.5 × VDS × ID × (tr + tf) × fs
- ANALYSIS
  ═══════════════════════════════════
  Vin=24V | Vout=-12V  Iout=3A | fs=300kHz | D=0.333 | eff=88%
  ━━━━━━━━━━━━━━━━━━━━━━
  INDUCTOR — SRP1245A-220M (22uH)
  ━━━━━━━━━━━━━━━━━━━━━━
  IL_avg   = Iin + Iout = 1.705 + 3       = 4.705A
  ΔIL      = Vin×D / (fs×L)               = 1.21A
  IL_peak  = IL_avg + ΔIL/2               = 5.31A
  IL_ripple_ratio = 1.21/4.705            = 25.7%
  L_crit   = (D')²×R / 2fs               = 2.97uH
  CCM confirmed: L=22uH >> Lcrit=2.97uH  ✓
  ━━━━━━━━━━━━━━━━━━━━━━
  MOSFET — FQD18N20V2 (200 V, 15 A, 140 mΩ)
  ━━━━━━━━━━━━━━━━━━━━━━
  Vds_stress  = Vin + Vout = 24+12        = 36V
  Vds_rated   = 36×1.2       = 43.2V → 600V ✓ (20% derating)
  Id_rated    ≥ IL_peak                  = 5.31A → 15A  ✓
  ID_rms      = IL_avg × √D              = 2.72A
  P_cond      = ID_rms² × Rds(on)×1.3   = 2.72²×0.637 = 4.71W (30% derating)
  P_sw        = 0.5×Vds×IL_peak×(tr+tf)×fs = 0.5×36×5.31×16n×300k    = 0.46W
  P_total     = 4.71 + 0.57             = 5.12W
  ━━━━━━━━━━━━━━━━━━━━
  DIODE — STPS10L60S (60V, 10A, Vf=0.4V, DPAK)
  ━━━━━━━━━━━━━━━━━━━━
  Vr_stress   = Vin + Vout               = 36V
  Vr_rated    = 36×1.2                  = 43.2V → 60V  ✓
  ID_avg      = Iout                    = 3A
  ID_peak     = IL_peak                 = 5.31A
  P_diode     = Vf×Iout×(1-D)          = 0.4×3×0.667  = 0.8W
  ━━━━━━━━━━━━━━━━━━━━
  OUTPUT CAPACITOR — KRM55WR71H476MH13K ×2 (47uF,50V,X7R)
  ━━━━━━━━━━━━━━━━━━━━
  C_min       = Iout×D / (fs×ΔVout)     = 27.7uF
  C_nominal   = 2×47                    = 94uF
  C_derated   @ 12V = 2×39.6           = 79.2uF > 27.7uF ✓
  ΔVout_target= 1%×12                  = 120mV
  ESR_max     = 0.5×ΔVout/ΔIL  = 49.6mΩ
  (the ESR can contribute max by a 50% to the total allowed ripple)
  ESR_eff     = 4mΩ/2                  = 2mΩ << 49.6mΩ ✓
  IC_rms      = Iout×√(D/D')           = 2.12A
  IC_rms/cap  = 2.12/2                 = 1.06A ✓
  ━━━━━━━━━━━━━━━━━━━━━
  INPUT CAPACITOR — KRM55WR71H476MH13K ×2 (47uF,50V,X7R)
  ━━━━━━━━━━━━━━━━━━━━━
  C_min       = Iout×D/(fs×ΔVin×D')    = 20.8uF
  C_nominal   = 2×47                   = 94uF
  C_derated   @ 24V = 2× 26.6uF         = 53.2uF > 20.8uF ✓
  ΔVin_target = 1%×24                 = 240mV
  ESR_max     = 0.5×ΔVin/IL_peak      = 22.6mΩ
  ICin_rms    = IL×√(D×D')            = 2.22A ✓
  Vrated      = 32×1.5                = 48V → 50V ✓
  Cin impedance Zcin	                            = 1/(2π×fs×Cin) + ESRcin              = 0.413Ω
  Cdamp impedance Zcdamp	         = 1/(2π×fs×Cdamp) + ESRdamp       = 0.013Ω
  IRMS Total Input Caps (Cin +Cdamp)    =  IL×√(D×D')                                = 2.22A
  IRMS Cdamp 		          = Zcdamp / (Zcdamp +Zcin)              = 2.16A✓
  ━━━━━━━━━━━━━━━━━━━━━━
  POWER BUDGET
  ━━━━━━━━━━━━━━━━━━━━━━
  P_mosfet    = 5.17W
  P_diode     = 0.80W
  P_total     = 6.08W
  η_estimated = Pout/(Pout+Ploss) = 36/(36+6.08) = 85.6%
- Latch-off / hiccup OCP:
  Q1 hits 11A once, OCP trips, gate goes off, converter stops (or waits to retry). The 396W linear event happens once → single pulse is correct.
  Cycle-by-cycle OCP:
  Q1 hits 11A, gets turned off for that cycle, then turns back on next cycle and hits 11A again... repeating every switching period for several ms during a sustained overload. Now the high-power linear crossing repeats every cycle → this is a pulse train, and you should use the duty-cycle curve, NOT single pulse.
- FQD18N20V2 @{"Id":"OXAJZKDU\AFEYGLPV","ObjectType":2}  — SOA CALCULATION
  ════════════════════════════════════════════════════════
  Package: DPAK | 200V | 15A | Rth(j-c)=1.5°C/W | Tjmax=150°C
  TA = 40°C (max ambient)
  SOA points (Fig.9 @ Vds=36V, 25°C):
  t1 = 1ms  → ISOA = 20A
  t2 = 10ms → ISOA = 7A
  POWER-LAW FIT:
  SOA(t) = a × t^m   (t in seconds)
  m = ln(20/7)/ln(1ms/10ms) = 1.050/-2.303 = -0.456
  a = 20/(1ms)^(-0.456) = 0.8575
  SOA(t) = 0.8575 × t^(-0.456)
  ════════════════════════════════════════════════════════
  CASE 1 — NORMAL SWITCHING
  ════════════════════════════════════════════════════════
  • ON-state Vds in RDSon region, SOA-safe (low Vds)
  • Switching edges: cross active region but last ~20ns << 10µs
  → far inside SOA pulse limit
  ID_peak = 5.31A << SOA(10µs) → far inside SOA  ✓
  ════════════════════════════════════════════════════════
  CASE 2 — STARTUP (OCP clamp = 11A)
  ════════════════════════════════════════════════════════
  Vds = Vin+|Vout| = 36V
  P_pulse = Vds × I_OCP = 36 × 11 = 396W
  Zth(j-c) read from Fig.11 SINGLE-PULSE curve:
  t=1ms → Zth=0.17    t=2ms → Zth=0.25    t=3ms → Zth=0.30
  (arbitrary sweep points to locate the current/pulse limit)
  Tj = TA + Zth(t) × P_pulse
  ISOA_derated = SOA(t) × (Tjmax - Tj)/(Tjmax - 25)
  t=0.64ms: Tj=40+0.136×396=94°C
  SOA25=0.8575×(0.64ms)^-0.456=24.5A
  der=24.5×(150-94)/125=11.0A  = 11A ◄ LIMIT
  t=1ms:   Tj=40+0.17×396=108°C
  SOA25=20.0A, der=20.0×(150-108)/125=6.8A  <11A ✗
  CHECK: I_OCP=11A vs ISOA_derated
  t≤0.64ms: 11A ≤ ISOA_derated   ✓ PASS
  t>0.64ms: 11A > ISOA_derated    ✗ FAIL
  ════════════════════════════════════════════════════════
  RESULT
  ════════════════════════════════════════════════════════
  Max safe linear pulse at 11A/36V (TA=40°C) = 0.64ms
  → OCP must turn Q1 OFF within 0.64ms of reaching 11A.
  Cycle-by-cycle: one period = 3.3µs @300kHz, far inside the 0.64ms safe window ✓